# Altium project mario_kart_circuits.PrjPcb
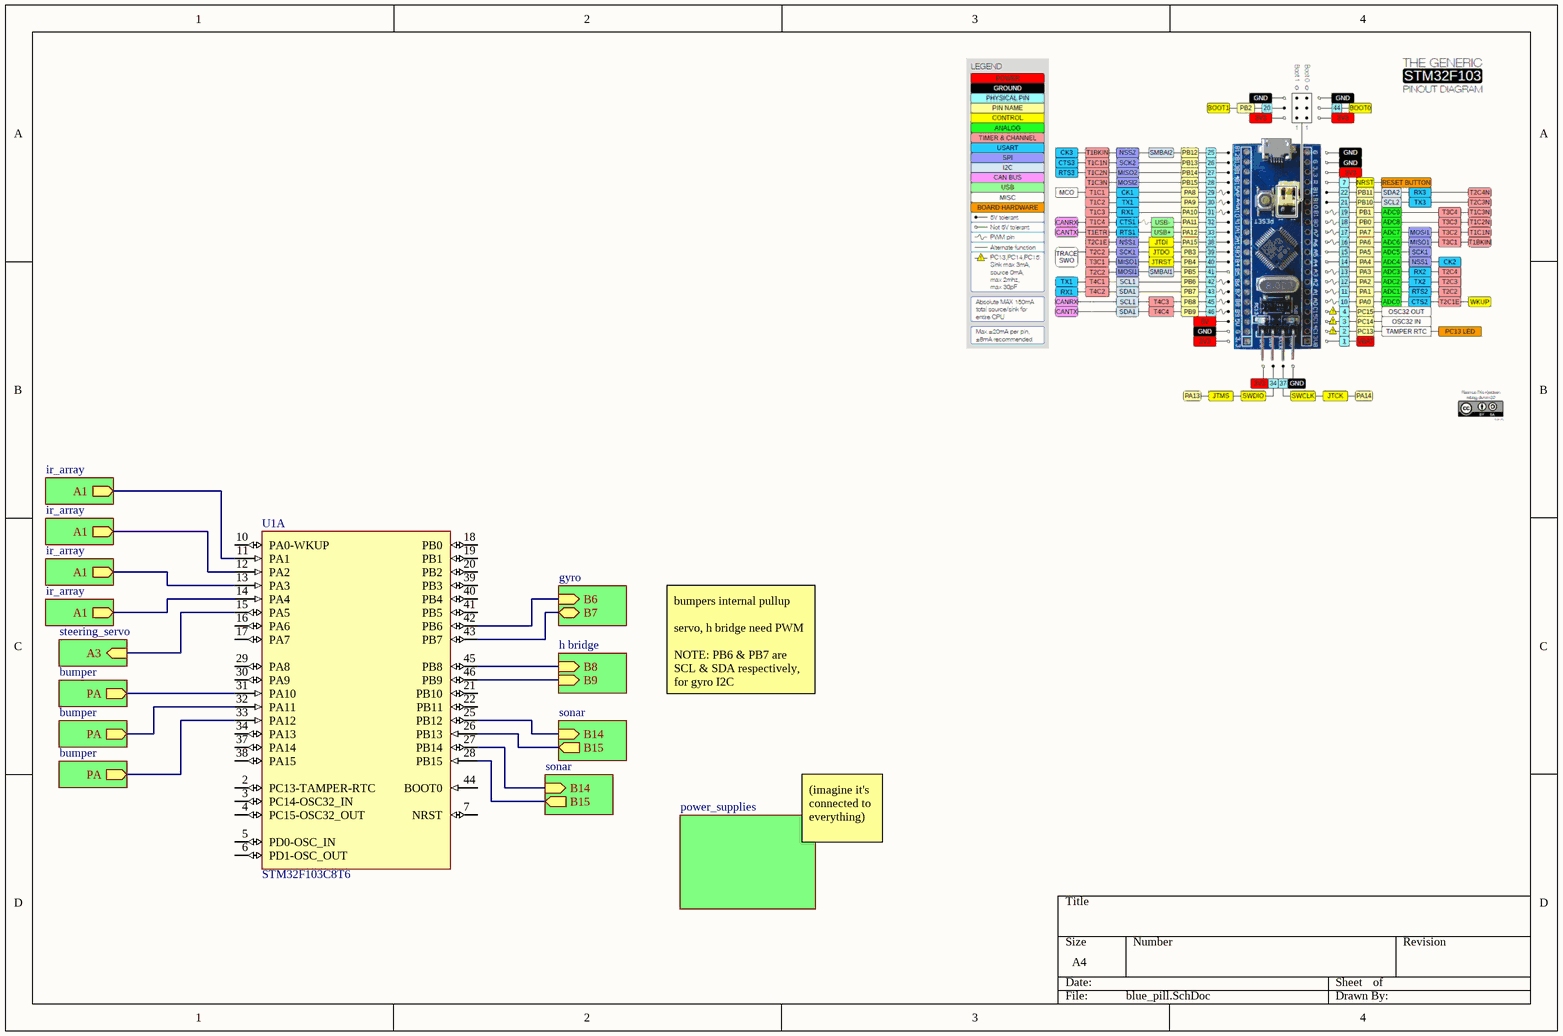
[diagram p0: blue_pill.SchDoc]
8 sheets, 104 parts. Net scope: hierarchical (ports join the sheet entries above them; power ports are global).
Sheets:
  blue_pill.SchDoc
    Designator = ir_array.SchDoc
    Designator = power_supplies.SchDoc
    Designator = bumper.SchDoc
    Designator = bumper.SchDoc
    Designator = bumper.SchDoc
    Designator = gyro.SchDoc
    Designator = sonar.SchDoc
    Designator = sonar.SchDoc
    Designator = h bridge.SchDoc
    Designator = ir_array.SchDoc
    Designator = steering_servo.SchDoc
    Designator = ir_array.SchDoc
    Designator = ir_array.SchDoc

## Sheet blue_pill.SchDoc
size A4; SheetNumber: 1; SheetTotal: 8

### Parts
U1  STM32F103C8T6  [STM-LQFP48_L]  (part A of 2)

### Sub-sheets
Designator = ir_array: A1 (out)
Designator = power_supplies: no entries
Designator = bumper: PA (out)
Designator = bumper: PA (out)
Designator = bumper: PA (out)
Designator = gyro: B6 (in), B7 (bidir)
Designator = sonar: B14 (in), B15 (out)
Designator = sonar: B14 (in), B15 (out)
Designator = h bridge: B8 (in), B9 (in)
Designator = ir_array: A1 (out)
Designator = steering_servo: A3 (in)
Designator = ir_array: A1 (out)
Designator = ir_array: A1 (out)

### Nets
ECHO: U1.26(PB13) ; sheet Designator/B15
ECHO: U1.28(PB15) ; sheet Designator/B15  [a separate net that carries the same name]
SCL: U1.42(PB6) ; sheet Designator/B6
SDA: U1.43(PB7) ; sheet Designator/B7
TRIG: U1.25(PB12) ; sheet Designator/B14
TRIG: U1.27(PB14) ; sheet Designator/B14  [a separate net that carries the same name]
NetC1_Designator#1_1: U1.31(PA10) ; sheet Designator/PA
NetC1_Designator#2_1: U1.32(PA11) ; sheet Designator/PA
NetC1_Designator#3_1: U1.33(PA12) ; sheet Designator/PA
NetC9_Designator#1_2: U1.11(PA1) ; sheet Designator/A1
NetC9_Designator#2_2: U1.12(PA2) ; sheet Designator/A1
NetC9_Designator#3_2: U1.13(PA3) ; sheet Designator/A1
NetC9_Designator#4_2: U1.14(PA4) ; sheet Designator/A1
NetQ3_2: U1.15(PA5) ; sheet Designator/A3
NetQ6_2: U1.45(PB8) ; sheet Designator/B8
NetQ8_2: U1.46(PB9) ; sheet Designator/B9

Not connected (* = marked no-connect by the designer): U1 2(PC13-TAMPER-RTC) 3(PC14-OSC32_IN) 4(PC15-OSC32_OUT) 5(PD0-OSC_IN) 6(PD1-OSC_OUT) 7(NRST) 10(PA0-WKUP) 16(PA6) 17(PA7) 18(PB0) 19(PB1) 20(PB2) 21(PB10) 22(PB11) 29(PA8) 30(PA9) 34(PA13) 37(PA14) 38(PA15) 39(PB3) 40(PB4) 41(PB5) 44(BOOT0)

### Notes on the sheet
- bumpers internal pullup
  servo, h bridge need PWM
  NOTE: PB6 & PB7 are SCL & SDA respectively, for gyro I2C
- (imagine it's connected to everything)

### Library data of the parts
U1 = CMP-0237-00215-3: ARM Cortex-M3 32-bit MCU, 64 KB Flash, 20 KB Internal RAM, 37 I/Os, 48-pin LQFP, -40 to 85 degC, Tray; Supply Voltage(Vcc) min (V): 2; Internal RAM Size (kB): 20; FLASH Size (Prog) (kB): 64; A/D Converter: 2x12-bit (10 Channel); I/Os (High Current): 37; Operating Frequency(F) (Processor speed) (MHz): 72; Core: ARM Cortex-M3; ComponentLink3Description: Package Specification; Mounting Technology: Surface Mount; PartNumber: STM32F103C8T6; PackageReference: LQFP48; Packing: Tray; ComponentLink3URL: http://www.st.com/st-web-ui/static/active/en/resource/technical/document/datasheet/DM00058181.pdf; DatasheetVersion: Rev. 16; ComponentLink1URL: http://www.st.com/web/en/home.html; PackageVersion: Rev. 6, 06/2013; ComponentLink2URL: http://www.st.com/st-web-ui/static/active/en/resource/technical/document/datasheet/CD00161566.pdf; ComponentLink1Description: Manufacturer URL; ComponentLink2Description: Datasheet; PackageDescription: 48-Pin Low Profile Quad Flat Package, 7 x 7 mm Body, 0.5 mm Pitch

## Sheet ir_array.SchDoc
size A4; SheetNumber: 4; SheetTotal: 8
Used 4 times, as channels Designator, Designator, Designator, Designator. Parts and nets are listed once, with the designators drawn on the sheet.
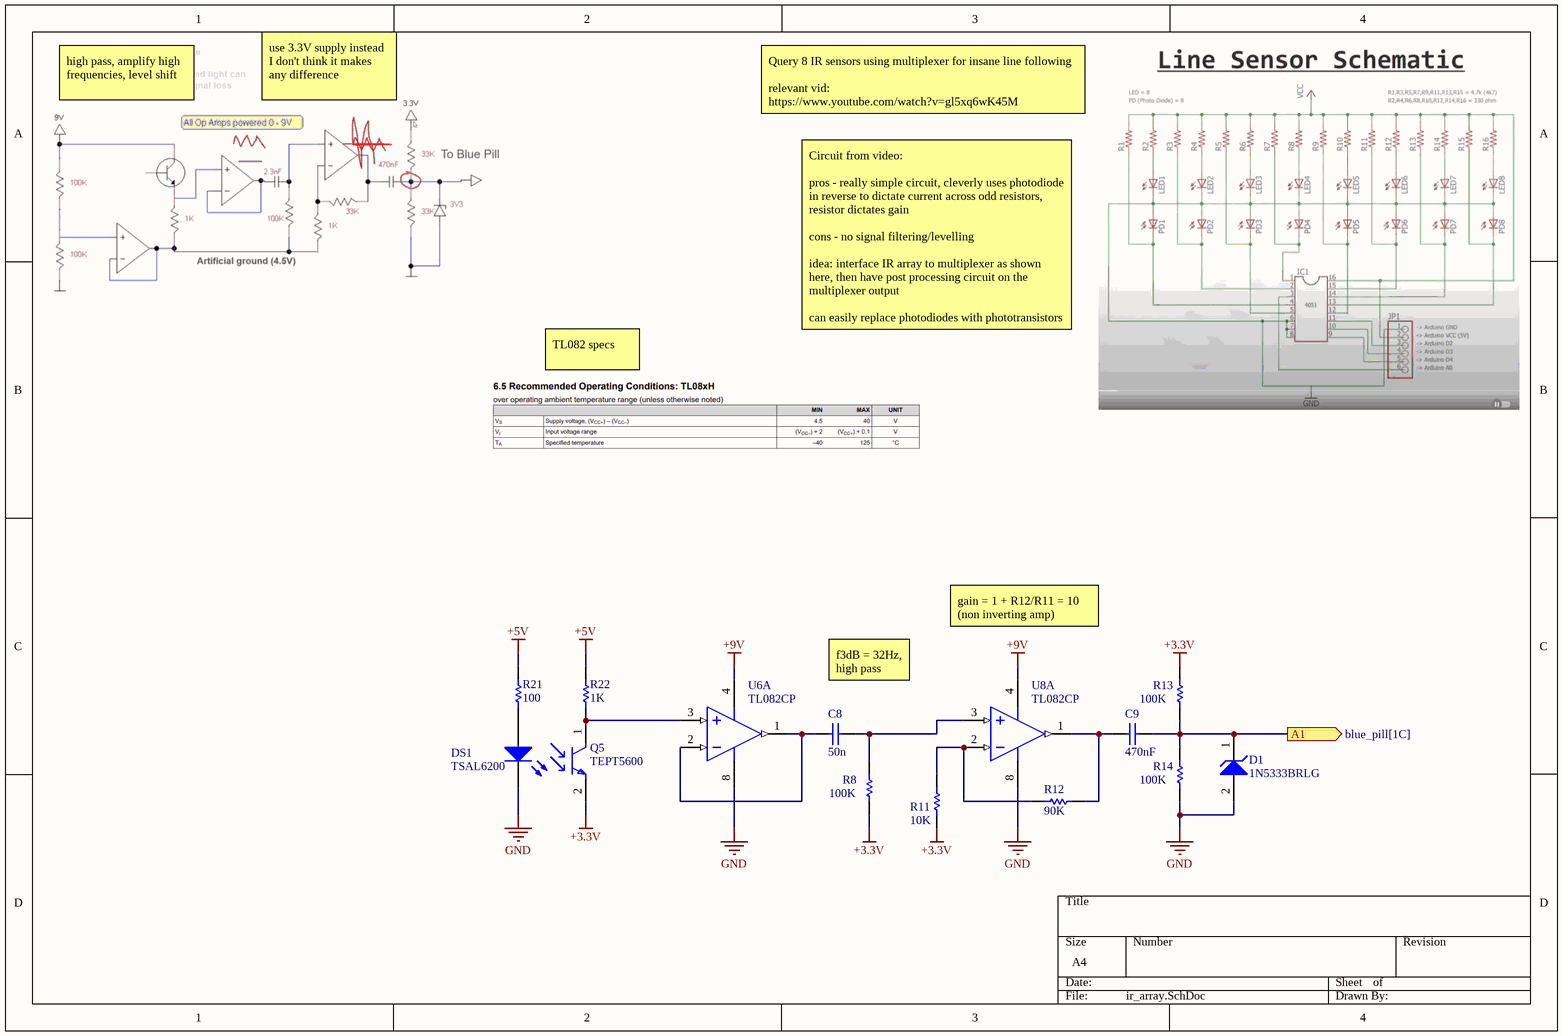
[diagram p1: ir_array.SchDoc]

### Parts
C8  value 50n  (hidden comment: Capacitor)
C9  value 470nF  (hidden comment: Capacitor)
D1  1N5333BRLG  [ONSC-SURMETIC40-2-017AA-01]
DS1  TSAL6200  [VISH-TSAL6200]
Q5  TEPT5600  [FP-6_544-5185_03-4-MFG]
R8  value 100K  (hidden comment: Resistor)
R11  value 10K  (hidden comment: Resistor)
R12  value 90K  (hidden comment: Resistor)
R13  value 100K  (hidden comment: Resistor)
R14  value 100K  (hidden comment: Resistor)
R21  value 100  (hidden comment: Resistor)
R22  value 1K  (hidden comment: Resistor)
U6  TL082CP  [P0008A]  (part A of 2)
U8  TL082CP  [P0008A]  (part A of 2)

### Ports
A1 (out, see blue_pill[1C])

### Nets
+3.3V: Q5.2(E) R8.2 R11.2 R13.1
+5V: R21.1 R22.1
+9V: U6.4(VCC-) U8.4(VCC-)
GND: D1.2(A) DS1.2(K) R14.2 U6.8(VCC+) U8.8(VCC+)
A1: C9.2 D1.1(K) R13.2 R14.1 ; port A1
NetC8_1: C8.1 U6.1(OUT1) U6.2(IN1-)
NetC8_2: C8.2 R8.1 U8.3(IN1+)
NetC9_1: C9.1 R12.1 U8.1(OUT1)
NetDS1_1: DS1.1(A) R21.2
NetQ5_1: Q5.1(C) R22.2 U6.3(IN1+)
NetR11_1: R11.1 R12.2 U8.2(IN1-)

### Channels
Designator: designators end in _Designator#1; ports A1=NetC9_Designator#1_2
Designator: designators end in _Designator#2; ports A1=NetC9_Designator#2_2
Designator: designators end in _Designator#3; ports A1=NetC9_Designator#3_2
Designator: designators end in _Designator#4; ports A1=NetC9_Designator#4_2

### Notes on the sheet
- high pass, amplify high frequencies, level shift
- use 3.3V supply instead I don't think it makes any difference
- Query 8 IR sensors using multiplexer for insane line following
  relevant vid: https://www.youtube.com/watch?v=gl5xq6wK45M
- TL082 specs
- Circuit from video:
  pros - really simple circuit, cleverly uses photodiode in reverse to dictate current across odd resistors, resistor dictates gain
  cons - no signal filtering/levelling
  idea: interface IR array to multiplexer as shown here, then have post processing circuit on the multiplexer output
  can easily replace photodiodes with phototransistors
- gain = 1 + R12/R11 = 10
  (non inverting amp)
- f3dB = 32Hz, high pass

### Library data of the parts
C8 C9 = Capacitor: SimulationGenericComponent: True
D1 = CMP-1060-01301-1: 5 W Zener Voltage Regulator, 2-Pin Surmetic(TM) 40, Pb-Free, Tape and Reel; Manufacturer: On Semiconductor; VZ Typ (V): 3.3; P Max (W): 5; DatasheetVersion: Rev. 14; PackageVersion: Rev. O, 09/2005; Mounting Technology: Through Hole; ComponentLink2URL: http://www.onsemi.cn/pub_link/Collateral/1N5333B-D.PDF; Packing: Tape and Reel; PartNumber: 1N5333BRLG; PackageDescription: 2-Pin, Axial Lead, Diameter 3.49 mm; RoHS: Pb-Free; ComponentLink3Description: Package Specification; PackageReference: SURMETIC40-2-017AA-01; ComponentLink1Description: Manufacturer URL; ComponentLink3URL: http://www.onsemi.cn/pub_link/Collateral/017AA.PDF; ComponentLink1URL: http://www.onsemi.com/; ComponentLink2Description: Datasheet
DS1 = CMP-2000-07327-1: High Power Infrared Emitting Diode, GaAlAs, MQW, 1.35 V, 100 mA, -40 to 85 degC, 2-Pin THD, RoHS, Bulk; Manufacturer: Vishay; Lum Intensity: 500mW/srmcd; Product Depth (mm): 5.8mm; Type: IrLED; Luminous Intensity: 500mW/sr; Forward Voltage: 3V; Shape Type: Circular; Peak Wavelength: 950nm; Rad Hardened: No; Product Height (mm): 8.7mm; Number of  Elements: 1; Forward Current: 100mA; High Brightness: Yes; Reverse Voltage: 5V; DELETED: Compliant; Power Dissipation: 160W; Viewing Angle: 34deg; Lens Type: Colored; Packaging: Bulk; Lens Dimensions: 5x5x7.7mm; Package Reference: TSAL6200; Chip Material: GaAlAs; Package Description: 2-Pin Through Hole Device, Dia 5.8 mm, Pitch 2.54 mm; Main Category: IrLED; Manufacturer URL: http://www.vishay.com/; Product Length (mm): 5.8mm; Datasheet URL: http://www.vishay.com/docs/81010/tsal6200.pdf; Operating Temperature Classification: Industrial; Package Type: T-13/4; Pin Count: 2; Mounting: ThroughHole; Mounting Technology: ThroughHole; Test Current (It): 100mA; Datasheet Version: Rev. 2.4, 03/2014; Operating Temp Range: -40Cto85C
Q5 = CMP-02533-000004-1: SENSOR PHOTO 570NM TOP VIEW RAD; Number of Channels: 1; Collector Emitter Voltage (VCEO): 6V; Output Type: Analog; Power Consumption: 100mW; Max Collector Current: 20mA; Lens Style: Domed; Polarity: NPN; Dark Current: 50nA; Viewing Angle: 20°; Operating Supply Voltage: 5V; Package Material: SILICON; Wavelength: 570nm; Width: 5.75mm; Power Dissipation: 100mW; Package Quantity: 4000; Radiation Hardening: No; RoHS Compliant: Yes; Lead Free: Lead Free; Max Power Dissipation: 100mW; Max Operating Temperature: 85°C; Length: 5.75mm; Case/Package: Radial; Number of Elements: 1; Number of Pins: 2; Min Operating Temperature: -40°C; Mount: Through Hole; Height: 8mm; Orientation: Top View; Series: -; Collector Emitter Breakdown Voltage: 6V; Packaging: Bulk
R8 R11-R14 R21 R22 = Resistor: TC1: 0; SimulationGenericComponent: True; TC2: 0
U6 U8 = CMP-0055-00158-5: JFET-Input Operational Amplifier, 7 to 36 V, 0 to 70 degC, 8-pin DIP (P8), Pb-Free (RoHS); Manufacturer: Texas Instruments; Total Supply Voltage(Max)(+5V is 5, +/-5V is 10): 36; Rating: Catalog; Number of Channels: 2; Slew Rate(Typ)(V/us): 13; CMRR(Min)(dB): 70; Sub Family: General Purpose Amplifier, High Supply Voltage Amplifier (>=30V); Offset Drift(Typ)(uV/C): 18; Total Supply Voltage(Min)(+5V is 5, +/-5V is 10): 7; IIB(Max)(pA): 400; GBW(Typ)(MHz): 3; Iq per channel(Max)(mA): 2.8; Vio (25C)(Max)(mV): 15; PackageDescription: 8-Pin Plastic In-Line, Body 9.59 x 6.35 mm, Pitch 2.54 mm; ComponentLink2URL: http://www.ti.com/lit/ds/symlink/tl082.pdf; Mounting Technology: Through Hole; Code_JEDEC: MS-001; ComponentLink1Description: Manufacturer URL; ComponentLink3Description: Package Specification; PartNumber: TL082CP; PackageVersion: 4040082/E, 04/2010; Eco-Plan: Pb-Free (RoHS); ComponentLink1URL: http://www.ti.com/; PackageReference: P0008A; ComponentLink3URL: http://www.ti.com/litv/pdf/mpdi001b; DatasheetVersion: SLOS081G; ComponentLink2Description: Datasheet; Vn at 1kHz(Typ)(nV/rtHz): 18

## Sheet power_supplies.SchDoc
size A4; SheetNumber: 2; SheetTotal: 8
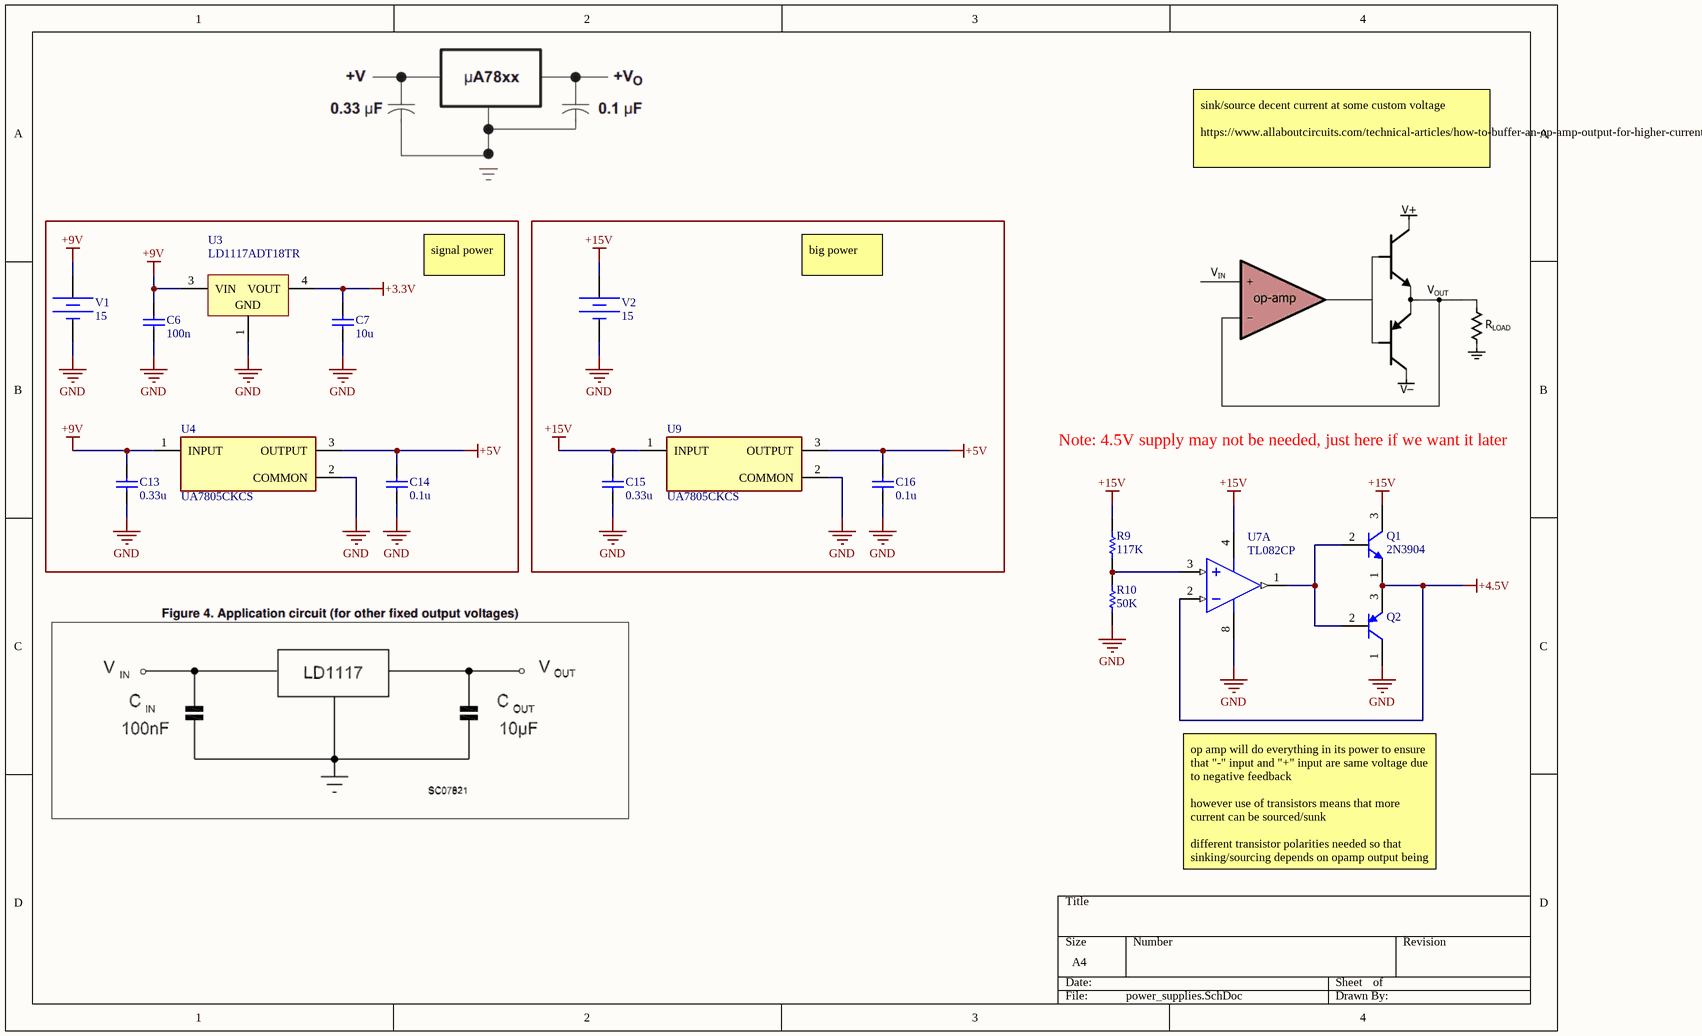
[diagram p2: power_supplies.SchDoc]

### Parts
C6  value 100n  (hidden comment: Capacitor)
C7  value 10u  (hidden comment: Capacitor)
C13  value 0.33u  (hidden comment: Capacitor)
C14  value 0.1u  (hidden comment: Capacitor)
C15  value 0.33u  (hidden comment: Capacitor)
C16  value 0.1u  (hidden comment: Capacitor)
Q1  2N3904  [ONSC-TO-92-3-29-11]
Q2  BC327-40ZL1G  [ONSC-TO-92-3-29-11_AM_BL]  (value not drawn)
R9  value 117K  (hidden comment: Resistor)
R10  value 50K  (hidden comment: Resistor)
U3  LD1117ADT18TR  [TO-252_N]
U4  UA7805CKCS  [FP-KCS0003B-MFG]
U7  TL082CP  [P0008A]  (part A of 2)
U9  UA7805CKCS  [FP-KCS0003B-MFG]
V1  DC Magnitude: 15  (hidden comment: Constant Voltage Source)
V2  DC Magnitude: 15  (hidden comment: Constant Voltage Source)

### Nets
+3.3V: C7.1 U3.4(VOUT)
+4.5V: Q1.1(E) Q2.3(E) U7.2(IN1-)
+5V: C14.1 C16.1 U4.3(OUTPUT) U9.3(OUTPUT)  [project net VCC]
+9V: C6.1 C13.1 U3.3(VIN) U4.1(INPUT) V1.1
+15V: C15.1 Q1.3(C) R9.1 U7.4(VCC-) U9.1(INPUT) V2.1
GND: C6.2 C7.2 C13.2 C14.2 C15.2 C16.2 Q2.1(C) R10.2 U3.1(GND) U4.2(COMMON) U7.8(VCC+) U9.2(COMMON) V1.2 V2.2
NetQ1_2: Q1.2(B) Q2.2(B) U7.1(OUT1)
NetR9_2: R9.2 R10.1 U7.3(IN1+)

### Notes on the sheet
- sink/source decent current at some custom voltage
  https://www.allaboutcircuits.com/technical-articles/how-to-buffer-an-op-amp-output-for-higher-current-part-2/
- signal power
- big power
- Note: 4.5V supply may not be needed, just here if we want it later
- op amp will do everything in its power to ensure that "-" input and "+" input are same voltage due to negative feedback
  however use of transistors means that more current can be sourced/sunk
  different transistor polarities needed so that sinking/sourcing depends on opamp output being positive or negative

### Library data of the parts
C6 C7 C13-C16 = Capacitor: SimulationGenericComponent: True
Q1 = CMP-2000-05562-1: General Purpose Transistor, NPN Silicon, 200 mA, 60 V, -55 to 150 degC, 3-Pin TO-92, RoHS, Bulk; Manufacturer: ONSemiconductor; Emitter- Base Voltage VEBO: 6V; Maximum Power Dissipation: 625mW; Maximum DC Collector Current: 0.2A; Collector- Emitter Voltage VCEO Max: 40V; Collector- Base Voltage VCBO: 60V; DC Collector/Base Gain hfe Min: 60; Configuration: Single; Collector-Emitter Saturation Voltage: 0.3V; Gain Bandwidth Product fT: 270MHz; Mounting Style: ThroughHole; Package / Case: TO-92-3(TO-226); Mounting Technology: ThroughHole; Minimum Operating Temperature: -65C; Datasheet Version: Rev. 8, 08/2012; Product Category: BipolarTransistors-BJT; Factory Pack Quantity: 5000; Transistor Polarity: NPN; Package Description: 3-Pin Transistor Outline, Body 4.825 x 3.685 mm, Pitch 1.27 mm; RoHS: Details; Datasheet URL: https://datasheet.ciiva.com/4725/2n3903-d-285841-4725808.pdf; Packaging: Bulk; Maximum Operating Temperature: +150C; Package Reference: TO-92-3-29-11; Brand: ONSemiconductor; Manufacturer URL: http://www.onsemi.com/
Q2 = CMP-1048-01589-1: Amplifier Transistor, PNP Silicon, 3-Pin TO-92, Pb-Free, Ammo Box; Manufacturer: On Semiconductor; IC Continuous (A): -0.8; ComponentLink2Description: Datasheet; ComponentLink1URL: http://www.onsemi.com/; Packing: Ammo Box; ComponentLink3Description: Package Specification; DatasheetVersion: Rev. 6; PartNumber: BC327-40ZL1G; PackageDescription: 3-Pin Transistor Outline, Body 4.825 x 3.685 mm, Pitch 1.27 mm; RoHS: TRUE; PackageReference: TO-92-3-29-11_AM_BL; Mounting Technology: Through Hole; ComponentLink1Description: Manufacturer URL; ComponentLink3URL: http://www.onsemi.com/pub_link/Collateral/MAC97-D.PDF; Polarity: PNP; PackageVersion: Rev. AM; ComponentLink2URL: http://www.onsemi.com/pub_link/Collateral/BC327-D.PDF
R9 R10 = Resistor: TC1: 0; SimulationGenericComponent: True; TC2: 0
U3 = CMP-0244-00136-1: 1A, Low Drop Positive Voltage Regulator, 1.8V, 3-Pin DPAK, Tape and Reel; DatasheetVersion: 2/12/2011; ComponentLink1Description: Manufacturer URL; ComponentLink1URL: http://www.st.com; ComponentLink2Description: Datasheet; PackageVersion: 2011; ComponentLink2URL: http://www.st.com/internet/com/TECHNICAL_RESOURCES/TECHNICAL_LITERATURE/DATASHEET/CD00002116.pdf; PackageReference: TO-252; PackageDescription: 3-Pin Transistor Outline Package 2.28 mm Pitch, 9.7 mm Lead Span (DPAK)
U4 U9 = CMP-04917-000031-1: IC REG LINEAR 5V 1.5A TO220-3; Manufacturer: Texas Instruments; Max Supply Voltage: 25V; Max Junction Temp: +125°C; Output Type: Fixed; Min Supply Voltage: 7V; Dropout Voltage: 2V; Number Of Outputs: 1; Category: IC; Height: 19.65mm; Temperature Range Low: 0°C; Device Class L1: Integrated Circuits (ICs); Manufacturer Part Number: UA7805CKCS; Device Class L3: Voltage Regulators - Linear; Temperature Range High: +125°C; Digikey Description: IC REG LINEAR 5V 1.5A TO220-3; Temperature: 0°C to +125°C; ComponentLink2Description: Datasheet; Lead Free: Yes; Device Class L2: Power Management ICs; Ipc Land Pattern Name: TO-220; Output Current: 1.5A; Output Voltage: 5V; Automotive: No; ComponentLink2URL: http://www.ti.com/lit/ds/symlink/ua78.pdf; Package: KCS0003B; Octopart: https://octopart.com/ua7805ckcs-texas+instruments-525328; Mouser Description: 1.5-A, 40-V, Fixed Positive Linear Regulators 3-TO-220 0 to 125; RoHS: TRUE
U7 = CMP-0055-00158-5: as U6 on sheet ir_array; PackageDescription: 8-Pin Plastic In-Line, Body 9.59 x 6.35 mm, Pitch 2.54 mm; ComponentLink2URL: http://www.ti.com/lit/ds/symlink/tl082.pdf; Mounting Technology: Through Hole; Code_JEDEC: MS-001; ComponentLink1Description: Manufacturer URL; ComponentLink3Description: Package Specification; PartNumber: TL082CP; PackageVersion: 4040082/E, 04/2010; Eco-Plan: Pb-Free (RoHS); ComponentLink1URL: http://www.ti.com/; PackageReference: P0008A; ComponentLink3URL: http://www.ti.com/litv/pdf/mpdi001b; DatasheetVersion: SLOS081G; ComponentLink2Description: Datasheet; Vn at 1kHz(Typ)(nV/rtHz): 18
V1 V2 = Battery: SimulationGenericComponent: True

## Sheet bumper.SchDoc
size A4; SheetNumber: 3; SheetTotal: 8
Used 3 times, as channels Designator, Designator, Designator. Parts and nets are listed once, with the designators drawn on the sheet.
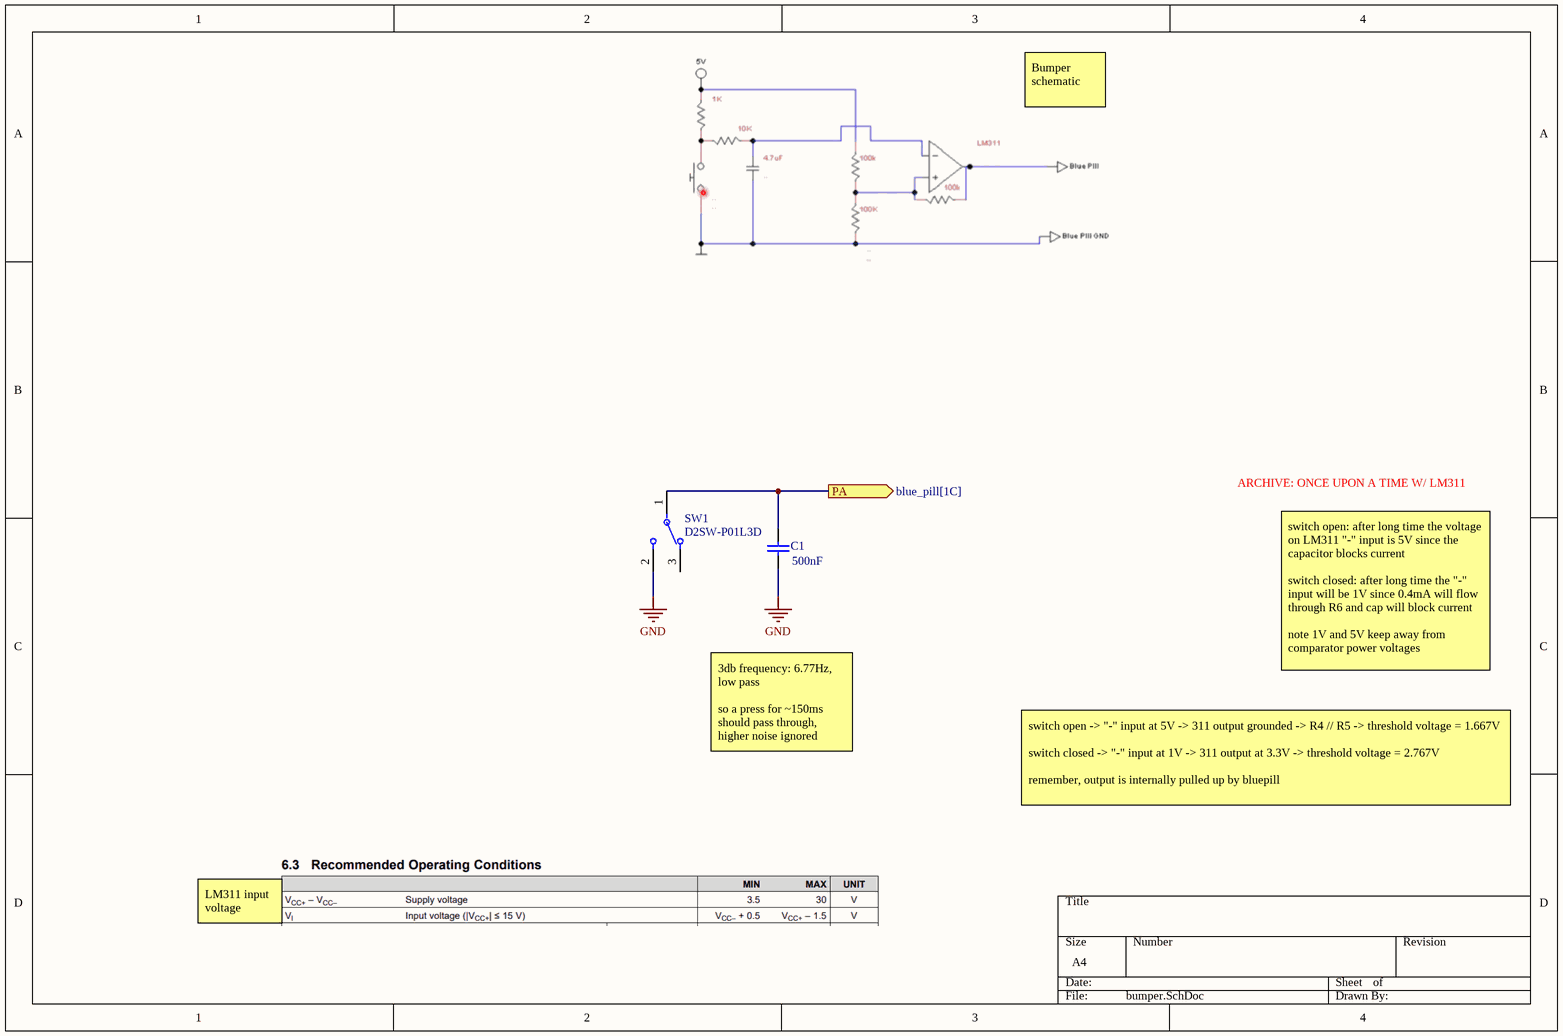
[diagram p3: bumper.SchDoc]

### Parts
C1  value 500nF  (hidden comment: Capacitor)
SW1  D2SW-P01L3D  [FP-D2SW-P01L3D-MFG]

### Ports
PA (out, see blue_pill[1C])

### Nets
GND: C1.2 SW1.2(NO)
PA: C1.1 SW1.1(COM) ; port PA

Not connected (* = marked no-connect by the designer): SW1 3(NC)

### Channels
Designator: designators end in _Designator#1; ports PA=NetC1_Designator#1_1
Designator: designators end in _Designator#2; ports PA=NetC1_Designator#2_1
Designator: designators end in _Designator#3; ports PA=NetC1_Designator#3_1

### Notes on the sheet
- Bumper schematic
- ARCHIVE: ONCE UPON A TIME W/ LM311
- switch open: after long time the voltage on LM311 "-" input is 5V since the capacitor blocks current
  switch closed: after long time the "-" input will be 1V since 0.4mA will flow through R6 and cap will block current
  note 1V and 5V keep away from comparator power voltages
- 3db frequency: 6.77Hz, low pass
  so a press for ~150ms should pass through, higher noise ignored
- switch open -> "-" input at 5V -> 311 output grounded -> R4 // R5 -> threshold voltage = 1.667V
  switch closed -> "-" input at 1V -> 311 output at 3.3V -> threshold voltage = 2.767V
  remember, output is internally pulled up by bluepill
- LM311 input voltage

### Library data of the parts
C1 = Capacitor: SimulationGenericComponent: True
SW1 = CMP-08833-000089-1: SWITCH SNAP ACT SPDT 100MA 125V; Number of Poles: 1; Operating Force: 0.6N; Switch Function: On-Mom; Approvals: UL; Electrical Life: 200000Cycles; Ratings: IP67; Max Voltage Rating (DC): 30V; Overtravel: 0.03inch; Operating Position: 0.42inch; Differential Travel: 0.031inch; Mechanical Life: 1000000Cycles; Actuator Type: SIMULATED ROLLER LEVER; Mount: Through Hole; Max Operating Temperature: 70°C; Voltage Rating (AC): 125V; Series: D2SW-P; Termination: PC Pin; Package Quantity: 500; RoHS Compliant: Yes; Min Operating Temperature: -20°C; Voltage Rating (DC): 30V; Contact Current Rating: 100mA; Current Rating: 100mA; Orientation: Straight; Packaging: Bulk; Lead Free: Lead Free; Contact Material: Gold; Throw Configuration: SPDT; Max Voltage Rating (AC): 125V

## Sheet gyro.SchDoc
size A4; SheetNumber: 7; SheetTotal: 7
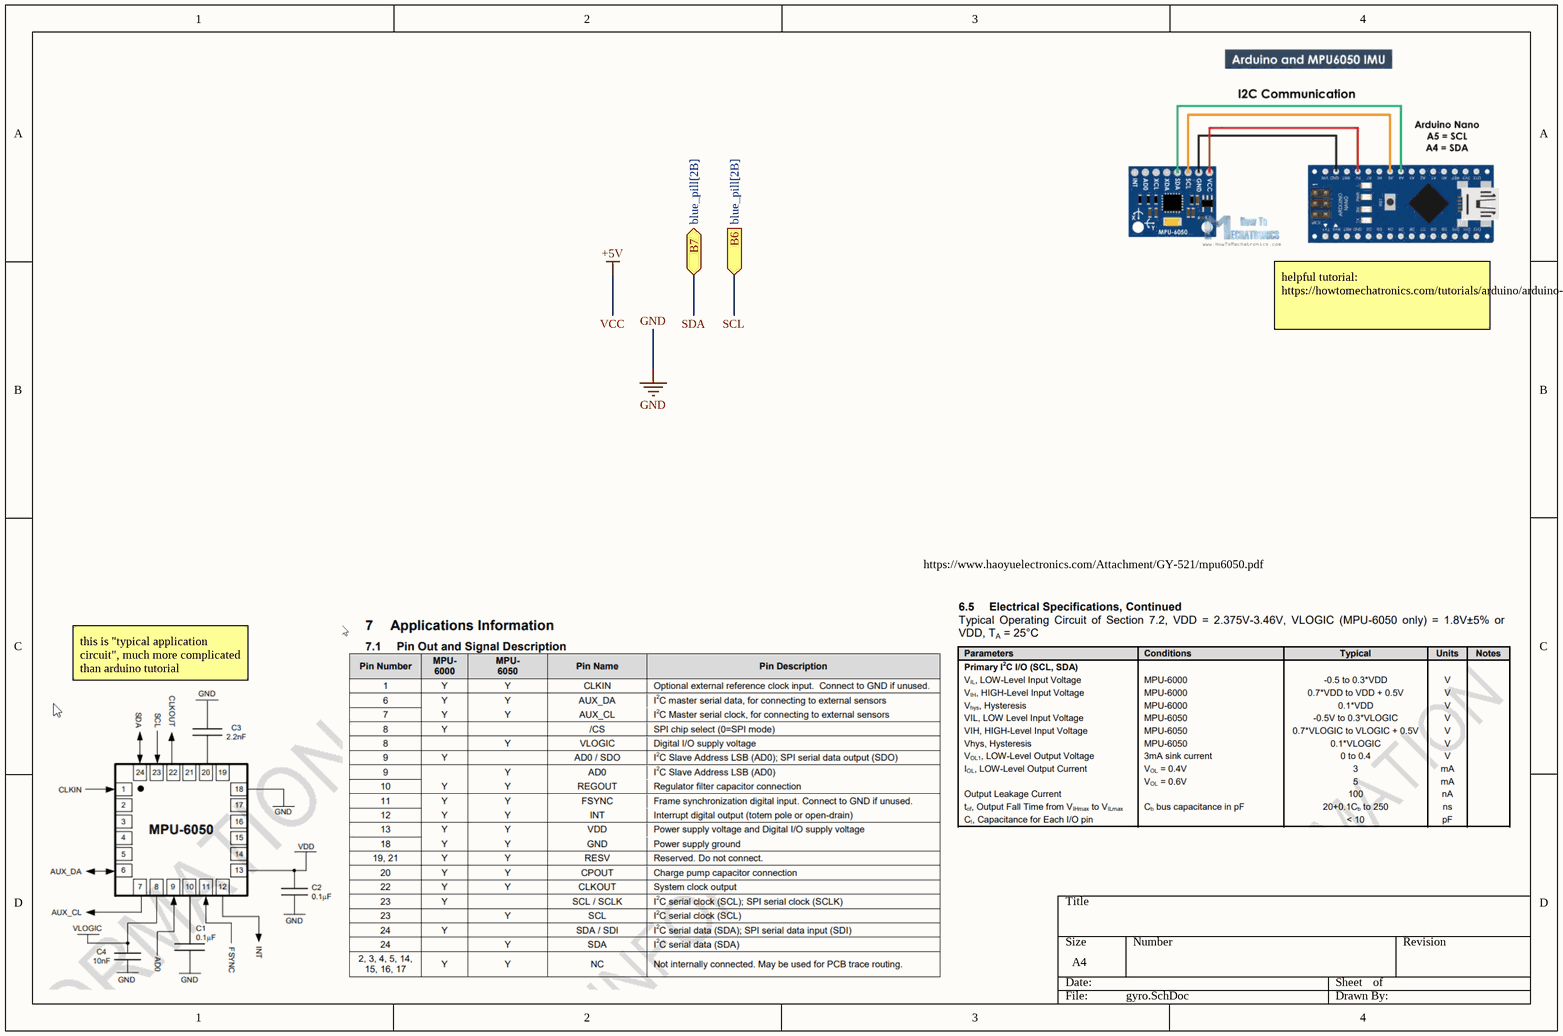
[diagram p4: gyro.SchDoc]

### Ports
B6 (in, see blue_pill[2B]), B7 (bidir, see blue_pill[2B])

### Notes on the sheet
- helpful tutorial: https://howtomechatronics.com/tutorials/arduino/arduino-and-mpu6050-accelerometer-and-gyroscope-tutorial/
- https://www.haoyuelectronics.com/Attachment/GY-521/mpu6050.pdf
- this is "typical application circuit", much more complicated than arduino tutorial

## Sheet sonar.SchDoc
size A4; SheetNumber: 8; SheetTotal: 9
Used 2 times, as channels Designator, Designator. Parts and nets are listed once, with the designators drawn on the sheet.
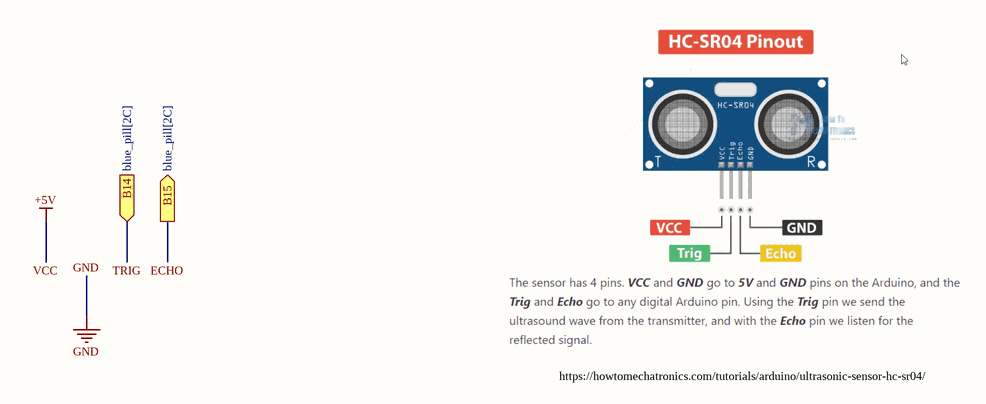
[diagram p5: sonar.SchDoc]

### Ports
B14 (in, see blue_pill[2C]), B15 (out, see blue_pill[2C])

### Channels
Designator: ports B14=TRIG B15=ECHO
Designator: ports B14=TRIG B15=ECHO

### Notes on the sheet
- https://howtomechatronics.com/tutorials/arduino/ultrasonic-sensor-hc-sr04/

## Sheet h bridge.SchDoc
size A4; SheetNumber: 9; SheetTotal: 9
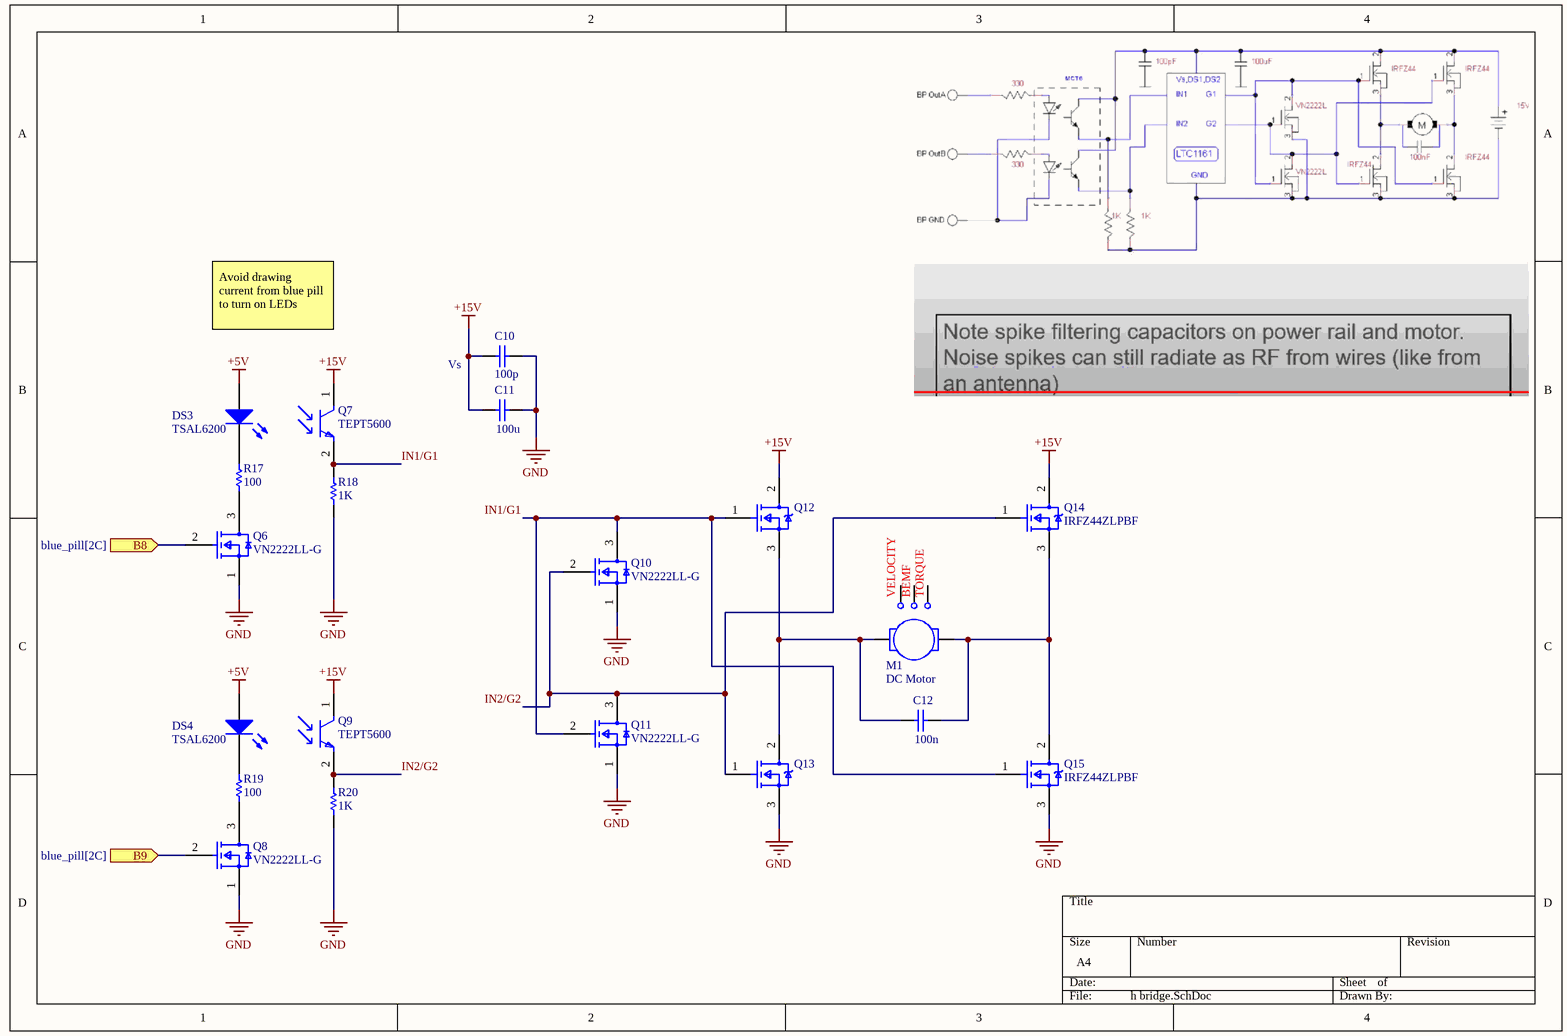
[diagram p6: h bridge.SchDoc]

### Parts
C10  value 100p  (hidden comment: Capacitor)
C11  value 100u  (hidden comment: Capacitor)
C12  value 100n  (hidden comment: Capacitor)
DS3  TSAL6200  [VISH-TSAL6200]
DS4  TSAL6200  [VISH-TSAL6200]
M1  DC Motor
Q6  VN2222LL-G  [FP-VN2222LL-G-MFG]
Q7  TEPT5600  [FP-6_544-5185_03-4-MFG]
Q8  VN2222LL-G  [FP-VN2222LL-G-MFG]
Q9  TEPT5600  [FP-6_544-5185_03-4-MFG]
Q10  VN2222LL-G  [FP-VN2222LL-G-MFG]
Q11  VN2222LL-G  [FP-VN2222LL-G-MFG]
Q12  IRFZ44ZLPBF  [FP-PG-TO262-3-MFG]  (value not drawn)
Q13  IRFZ44ZLPBF  [FP-PG-TO262-3-MFG]  (value not drawn)
Q14  IRFZ44ZLPBF  [FP-PG-TO262-3-MFG]
Q15  IRFZ44ZLPBF  [FP-PG-TO262-3-MFG]
R17  value 100  (hidden comment: Resistor)
R18  value 1K  (hidden comment: Resistor)
R19  value 100  (hidden comment: Resistor)
R20  value 1K  (hidden comment: Resistor)

### Ports
B8 (in, see blue_pill[2C]), B9 (in, see blue_pill[2C])

### Nets
+5V: DS3.1(A) DS4.1(A)  [project net VCC]
+15V: C10.1 C11.1 Q7.1(C) Q9.1(C) Q12.2(D) Q14.2(D)
GND: C10.2 C11.2 Q6.1(SOURCE) Q8.1(SOURCE) Q10.1(SOURCE) Q11.1(SOURCE) Q13.3(S) Q15.3(S) R18.2 R20.2
IN1/G1: Q7.2(E) Q10.3(DRAIN) Q11.2(GATE) Q12.1(G) Q15.1(G) R18.1
IN2/G2: Q9.2(E) Q10.2(GATE) Q11.3(DRAIN) Q13.1(G) Q14.1(G) R20.1
NetC12_1: C12.1 M1.1 Q12.3(S) Q13.2(D)
NetC12_2: C12.2 M1.2 Q14.3(S) Q15.2(D)
NetDS3_2: DS3.2(K) R17.1
NetDS4_2: DS4.2(K) R19.1
NetQ6_2: Q6.2(GATE) ; port B8
NetQ6_3: Q6.3(DRAIN) R17.2
NetQ8_2: Q8.2(GATE) ; port B9
NetQ8_3: Q8.3(DRAIN) R19.2

Not connected (* = marked no-connect by the designer): M1 3 4 5

### Notes on the sheet
- Avoid drawing current from blue pill to turn on LEDs
- Vs
- (in symbol DC Motor) VELOCITY; BEMF; TORQUE

### Library data of the parts
C10-C12 = Capacitor: SimulationGenericComponent: True
DS3 DS4 = CMP-2000-07327-1: as DS1 on sheet ir_array; Packaging: Bulk; Lens Dimensions: 5x5x7.7mm; Package Reference: TSAL6200; Chip Material: GaAlAs; Package Description: 2-Pin Through Hole Device, Dia 5.8 mm, Pitch 2.54 mm; Main Category: IrLED; Manufacturer URL: http://www.vishay.com/; Product Length (mm): 5.8mm; Datasheet URL: http://www.vishay.com/docs/81010/tsal6200.pdf; Operating Temperature Classification: Industrial; Package Type: T-13/4; Pin Count: 2; Mounting: ThroughHole; Mounting Technology: ThroughHole; Test Current (It): 100mA; Datasheet Version: Rev. 2.4, 03/2014; Operating Temp Range: -40Cto85C
M1 = DC Motor: LA: 1.5M; RA: 0.5; KE: 0.05; JM: 250U; BM: 0.1M; TL: 0; SimulationGenericComponent: True; KT: 0.05
Q6 Q8 Q10 Q11 = CMP-06369-000005-1: MOSFET N-CH 60V 0.23A TO92-3; Gate to Source Voltage (Vgs): 30V; Number of Elements: 1; Continuous Drain Current (ID): 230mA; Drain to Source Resistance: 7.5R; Element Configuration: Single; Power Dissipation: 1W; Max Operating Temperature: 150°C; Mount: Through Hole; Radiation Hardening: No; Lead Free: Lead Free; Number of Pins: 3; Packaging: Bulk; Package Quantity: 1000; Min Operating Temperature: -55°C; Case/Package: TO-92; Drain to Source Breakdown Voltage: 60V
Q7 Q9 = CMP-02533-000004-1: as Q5 on sheet ir_array; Wavelength: 570nm; Width: 5.75mm; Power Dissipation: 100mW; Package Quantity: 4000; Radiation Hardening: No; RoHS Compliant: Yes; Lead Free: Lead Free; Max Power Dissipation: 100mW; Max Operating Temperature: 85°C; Length: 5.75mm; Case/Package: Radial; Number of Elements: 1; Number of Pins: 2; Min Operating Temperature: -40°C; Mount: Through Hole; Height: 8mm; Orientation: Top View; Series: -; Collector Emitter Breakdown Voltage: 6V; Packaging: Bulk
Q12-Q15 = CMP-32901-000428-1: MOSFET N-CH 55V 51A TO262; Input Capacitance: 1.42nF; Drain to Source Resistance: 13.9mR; Gate to Source Voltage (Vgs): 20V; Turn-Off Delay Time: 33ns; Power Dissipation: 80W; Element Configuration: Single; Turn-On Delay Time: 14ns; Continuous Drain Current (ID): 51A; Max Operating Temperature: 175°C; Max Dual Supply Voltage: 55V; Drain to Source Voltage (Vdss): 55V; RoHS Compliant: Yes; Halogen Free: Halogen Free; Rds On Max: 13.9mR; Mount: Through Hole; Width: 0.19inch; Min Operating Temperature: -55°C; Length: 0.419inch; Lead Free: Contains Lead; Max Power Dissipation: 80W; Packaging: Rail/Tube; Height: 0.355inch; Number of Pins: 3; Case/Package: TO-262
R17-R20 = Resistor: TC1: 0; SimulationGenericComponent: True; TC2: 0

## Sheet steering_servo.SchDoc
size A4; SheetNumber: 5; SheetTotal: 8
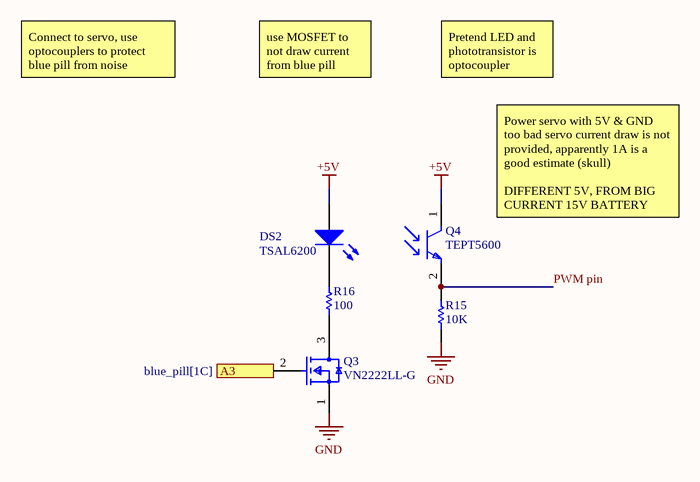
[diagram p7: steering_servo.SchDoc]

### Parts
DS2  TSAL6200  [VISH-TSAL6200]
Q3  VN2222LL-G  [FP-VN2222LL-G-MFG]
Q4  TEPT5600  [FP-6_544-5185_03-4-MFG]
R15  value 10K  (hidden comment: Resistor)
R16  value 100  (hidden comment: Resistor)

### Ports
A3 (in, see blue_pill[1C])

### Nets
+5V: DS2.1(A) Q4.1(C)  [project net VCC]
GND: Q3.1(SOURCE) R15.2
PWM pin: Q4.2(E) R15.1
NetDS2_2: DS2.2(K) R16.1
NetQ3_2: Q3.2(GATE) ; port A3
NetQ3_3: Q3.3(DRAIN) R16.2

### Notes on the sheet
- Connect to servo, use optocouplers to protect blue pill from noise
- use MOSFET to not draw current from blue pill
- Pretend LED and phototransistor is optocoupler
- Power servo with 5V & GND
  too bad servo current draw is not provided, apparently 1A is a good estimate (skull)
  DIFFERENT 5V, FROM BIG CURRENT 15V BATTERY

### Library data of the parts
DS2 = CMP-2000-07327-1: as DS1 on sheet ir_array; Packaging: Bulk; Lens Dimensions: 5x5x7.7mm; Package Reference: TSAL6200; Chip Material: GaAlAs; Package Description: 2-Pin Through Hole Device, Dia 5.8 mm, Pitch 2.54 mm; Main Category: IrLED; Manufacturer URL: http://www.vishay.com/; Product Length (mm): 5.8mm; Datasheet URL: http://www.vishay.com/docs/81010/tsal6200.pdf; Operating Temperature Classification: Industrial; Package Type: T-13/4; Pin Count: 2; Mounting: ThroughHole; Mounting Technology: ThroughHole; Test Current (It): 100mA; Datasheet Version: Rev. 2.4, 03/2014; Operating Temp Range: -40Cto85C
Q3 = CMP-06369-000005-1: as Q6 on sheet h bridge; Max Operating Temperature: 150°C; Mount: Through Hole; Radiation Hardening: No; Lead Free: Lead Free; Number of Pins: 3; Packaging: Bulk; Package Quantity: 1000; Min Operating Temperature: -55°C; Case/Package: TO-92; Drain to Source Breakdown Voltage: 60V
Q4 = CMP-02533-000004-1: as Q5 on sheet ir_array; Wavelength: 570nm; Width: 5.75mm; Power Dissipation: 100mW; Package Quantity: 4000; Radiation Hardening: No; RoHS Compliant: Yes; Lead Free: Lead Free; Max Power Dissipation: 100mW; Max Operating Temperature: 85°C; Length: 5.75mm; Case/Package: Radial; Number of Elements: 1; Number of Pins: 2; Min Operating Temperature: -40°C; Mount: Through Hole; Height: 8mm; Orientation: Top View; Series: -; Collector Emitter Breakdown Voltage: 6V; Packaging: Bulk
R15 R16 = Resistor: TC1: 0; SimulationGenericComponent: True; TC2: 0

## Nets that join several sheets
+3.3V: Designator (Q5_Designator#1.2 R8_Designator#1.2 R11_Designator#1.2 R13_Designator#1.1), power_supplies (C7.1 U3.4), Designator (Q5_Designator#2.2 R8_Designator#2.2 R11_Designator#2.2 R13_Designator#2.1), Designator (Q5_Designator#3.2 R8_Designator#3.2 R11_Designator#3.2 R13_Designator#3.1), Designator (Q5_Designator#4.2 R8_Designator#4.2 R11_Designator#4.2 R13_Designator#4.1)
+9V: Designator (U6_Designator#1.4 U8_Designator#1.4), power_supplies (5 pins), Designator (U6_Designator#2.4 U8_Designator#2.4), Designator (U6_Designator#3.4 U8_Designator#3.4), Designator (U6_Designator#4.4 U8_Designator#4.4)
+15V: power_supplies (6 pins), h bridge (6 pins)
GND: Designator (5 pins), power_supplies (14 pins), Designator (C1_Designator#1.2 SW1_Designator#1.2), Designator (C1_Designator#2.2 SW1_Designator#2.2), Designator (C1_Designator#3.2 SW1_Designator#3.2), h bridge (10 pins), Designator (5 pins), steering_servo (Q3.1 R15.2), Designator (5 pins), Designator (5 pins)
VCC: Designator (R21_Designator#1.1 R22_Designator#1.1), power_supplies (C14.1 C16.1 U4.3 U9.3), h bridge (DS3.1 DS4.1), Designator (R21_Designator#2.1 R22_Designator#2.1), steering_servo (DS2.1 Q4.1), Designator (R21_Designator#3.1 R22_Designator#3.1), Designator (R21_Designator#4.1 R22_Designator#4.1)
NetC1_Designator#1_1: blue_pill (U1.31), Designator (C1_Designator#1.1 SW1_Designator#1.1)
NetC1_Designator#2_1: blue_pill (U1.32), Designator (C1_Designator#2.1 SW1_Designator#2.1)
NetC1_Designator#3_1: blue_pill (U1.33), Designator (C1_Designator#3.1 SW1_Designator#3.1)
NetC9_Designator#1_2: blue_pill (U1.11), Designator (C9_Designator#1.2 D1_Designator#1.1 R13_Designator#1.2 R14_Designator#1.1)
NetC9_Designator#2_2: blue_pill (U1.12), Designator (C9_Designator#2.2 D1_Designator#2.1 R13_Designator#2.2 R14_Designator#2.1)
NetC9_Designator#3_2: blue_pill (U1.13), Designator (C9_Designator#3.2 D1_Designator#3.1 R13_Designator#3.2 R14_Designator#3.1)
NetC9_Designator#4_2: blue_pill (U1.14), Designator (C9_Designator#4.2 D1_Designator#4.1 R13_Designator#4.2 R14_Designator#4.1)
NetQ3_2: blue_pill (U1.15), steering_servo (Q3.2)
NetQ6_2: blue_pill (U1.45), h bridge (Q6.2)
NetQ8_2: blue_pill (U1.46), h bridge (Q8.2)